# Altium schematic sheet Microcontroller.SchDoc
size B; SheetNumber: 2; SheetTotal: 7
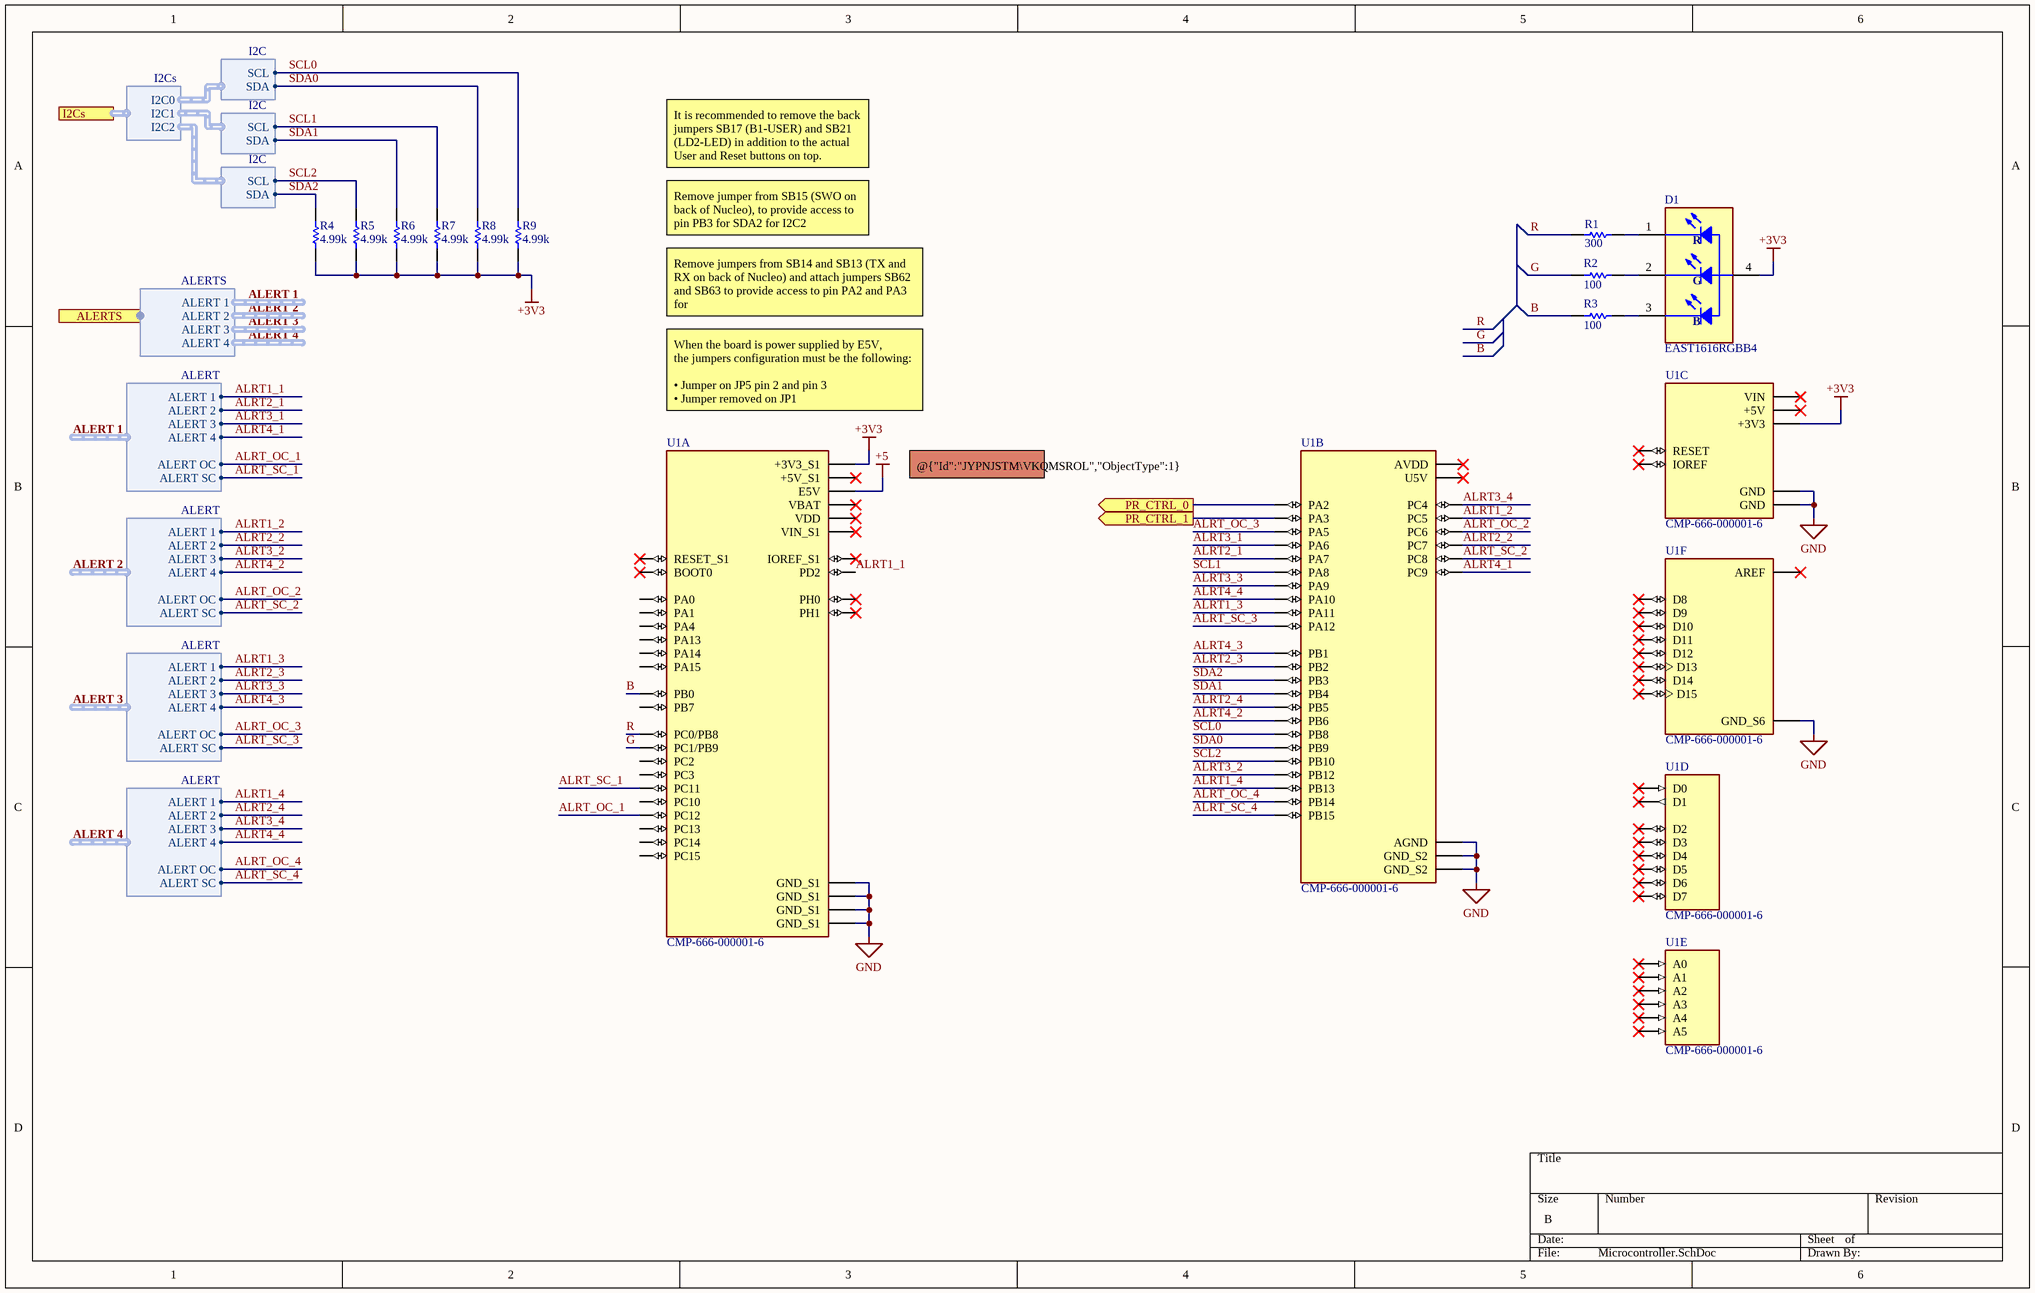
[diagram p0: Microcontroller.SchDoc]

## Parts
D1  EAST1616RGBB4  [FP-EAST1616RGBB4-MFG]
R1  value 300  [RES 0805_2012]  (hidden comment: ERJ-6ENF3000V)
R2  value 100  [RES 0805_2012]  (hidden comment: CRG0805F100R)
R3  value 100  [RES 0805_2012]  (hidden comment: CRG0805F100R)
R4  value 4.99k  [RES 0805_2012]  (hidden comment: ERJ-6ENF4991V)
R5  value 4.99k  [RES 0805_2012]  (hidden comment: ERJ-6ENF4991V)
R6  value 4.99k  [RES 0805_2012]  (hidden comment: ERJ-6ENF4991V)
R7  value 4.99k  [RES 0805_2012]  (hidden comment: ERJ-6ENF4991V)
R8  value 4.99k  [RES 0805_2012]  (hidden comment: ERJ-6ENF4991V)
R9  value 4.99k  [RES 0805_2012]  (hidden comment: ERJ-6ENF4991V)
U1  CMP-666-000001-6  [ST_NUCLEO-F401RE]  (parts A,B,C,D,E,F of 6)

## Ports
ALERTS (out, harness ALERTS), I2Cs (harness I2Cs), PR_CTRL_0 (out), PR_CTRL_1 (out)

## Harnesses
I2C: SDA, SCL
I2Cs: I2C1, I2C0, I2C2
ALERTS: ALERT 1, ALERT 2, ALERT 3, ALERT 4
ALERT: ALERT SC, ALERT OC, ALERT 1, ALERT 2, ALERT 3, ALERT 4

## Nets
+3V3: D1.4(COMMON_ANODE) R4.1 R5.1 R6.1 R7.1 R8.1 R9.1 U1.CN6_4(+3V3) U1.CN7_16(+3V3_S1)
+5: U1.CN7_6(E5V)
GND: U1.CN5_7(GND_S6) U1.CN6_6(GND) U1.CN6_7(GND) U1.CN7_8(GND_S1) U1.CN7_19(GND_S1) U1.CN7_20(GND_S1) U1.CN7_22(GND_S1) U1.CN10_9(GND_S2) U1.CN10_20(GND_S2) U1.CN10_32(AGND)
ALRT1_1: U1.CN7_4(PD2) ; harness ALERT.ALERT 1  [project net ALERT 1.ALERT 1]
ALRT1_2: U1.CN10_6(PC5) ; harness ALERT.ALERT 1  [project net ALERT 2.ALERT 1]
ALRT1_3: U1.CN10_14(PA11) ; harness ALERT.ALERT 1  [project net ALERT 3.ALERT 1]
ALRT1_4: U1.CN10_30(PB13) ; harness ALERT.ALERT 1  [project net ALERT 4.ALERT 1]
ALRT2_1: U1.CN10_15(PA7) ; harness ALERT.ALERT 2  [project net ALERT 1.ALERT 2]
ALRT2_2: U1.CN10_19(PC7) ; harness ALERT.ALERT 2  [project net ALERT 2.ALERT 2]
ALRT2_3: U1.CN10_22(PB2) ; harness ALERT.ALERT 2  [project net ALERT 3.ALERT 2]
ALRT2_4: U1.CN10_29(PB5) ; harness ALERT.ALERT 2  [project net ALERT 4.ALERT 2]
ALRT3_1: U1.CN10_13(PA6) ; harness ALERT.ALERT 3  [project net ALERT 1.ALERT 3]
ALRT3_2: U1.CN10_16(PB12) ; harness ALERT.ALERT 3  [project net ALERT 2.ALERT 3]
ALRT3_3: U1.CN10_21(PA9) ; harness ALERT.ALERT 3  [project net ALERT 3.ALERT 3]
ALRT3_4: U1.CN10_34(PC4) ; harness ALERT.ALERT 3  [project net ALERT 4.ALERT 3]
ALRT4_1: U1.CN10_1(PC9) ; harness ALERT.ALERT 4  [project net ALERT 1.ALERT 4]
ALRT4_2: U1.CN10_17(PB6) ; harness ALERT.ALERT 4  [project net ALERT 2.ALERT 4]
ALRT4_3: U1.CN10_24(PB1) ; harness ALERT.ALERT 4  [project net ALERT 3.ALERT 4]
ALRT4_4: U1.CN10_33(PA10) ; harness ALERT.ALERT 4  [project net ALERT 4.ALERT 4]
ALRT_OC_1: U1.CN7_3(PC12) ; harness ALERT.ALERT OC  [project net ALERT 1.ALERT OC]
ALRT_OC_2: U1.CN10_4(PC6) ; harness ALERT.ALERT OC  [project net ALERT 2.ALERT OC]
ALRT_OC_3: U1.CN10_11(PA5) ; harness ALERT.ALERT OC  [project net ALERT 3.ALERT OC]
ALRT_OC_4: U1.CN10_28(PB14) ; harness ALERT.ALERT OC  [project net ALERT 4.ALERT OC]
ALRT_SC_1: U1.CN7_2(PC11) ; harness ALERT.ALERT SC  [project net ALERT 1.ALERT SC]
ALRT_SC_2: U1.CN10_2(PC8) ; harness ALERT.ALERT SC  [project net ALERT 2.ALERT SC]
ALRT_SC_3: U1.CN10_12(PA12) ; harness ALERT.ALERT SC  [project net ALERT 3.ALERT SC]
ALRT_SC_4: U1.CN10_26(PB15) ; harness ALERT.ALERT SC  [project net ALERT 4.ALERT SC]
B: R3.1 U1.CN7_34(PB0)
G: R2.1 U1.CN7_36(PC1/PB9)
PR_CTRL_0: U1.CN10_35(PA2) ; port PR_CTRL_0
PR_CTRL_1: U1.CN10_37(PA3) ; port PR_CTRL_1
R: R1.1 U1.CN7_38(PC0/PB8)
SCL0: R9.2 U1.CN10_3(PB8) ; harness I2C.SCL
SCL1: R7.2 U1.CN10_23(PA8) ; harness I2C.SCL
SCL2: R5.2 U1.CN10_25(PB10) ; harness I2C.SCL
SDA0: R8.2 U1.CN10_5(PB9) ; harness I2C.SDA
SDA1: R6.2 U1.CN10_27(PB4) ; harness I2C.SDA
SDA2: R4.2 U1.CN10_31(PB3) ; harness I2C.SDA
NetD1_1: D1.1(RED_C) R1.2
NetD1_2: D1.2(GREEN_C) R2.2
NetD1_3: D1.3(BLUE_C) R3.2

Not connected (* = marked no-connect by the designer): U1 CN5_1(D8)* CN5_2(D9)* CN5_3(D10)* CN5_4(D11)* CN5_5(D12)* CN5_6(D13)* CN5_8(AREF)* CN5_9(D14)* CN5_10(D15)* CN6_2(IOREF)* CN6_3(RESET)* CN6_5(+5V)* CN6_8(VIN)* CN7_1(PC10) CN7_5(VDD)* CN7_7(BOOT0)* CN7_12(IOREF_S1)* CN7_13(PA13) CN7_14(RESET_S1)* CN7_15(PA14) CN7_17(PA15) CN7_18(+5V_S1)* CN7_21(PB7) CN7_23(PC13) CN7_24(VIN_S1)* CN7_25(PC14) CN7_27(PC15) CN7_28(PA0) CN7_29(PH0)* CN7_30(PA1) CN7_31(PH1)* CN7_32(PA4) CN7_33(VBAT)* CN7_35(PC2) CN7_37(PC3) CN8_1(A0)* CN8_2(A1)* CN8_3(A2)* CN8_4(A3)* CN8_5(A4)* CN8_6(A5)* CN9_1(D0)* CN9_2(D1)* CN9_3(D2)* CN9_4(D3)* CN9_5(D4)* CN9_6(D5)* CN9_7(D6)* CN9_8(D7)* CN10_7(AVDD)* CN10_8(U5V)*

## Notes on the sheet
- It is recommended to remove the back jumpers SB17 (B1-USER) and SB21 (LD2-LED) in addition to the actual User and Reset buttons on top.
- Remove jumper from SB15 (SWO on back of Nucleo), to provide access to pin PB3 for SDA2 for I2C2
- Remove jumpers from SB14 and SB13 (TX and RX on back of Nucleo) and attach jumpers SB62 and SB63 to provide access to pin PA2 and PA3 for @{"Id":"NLACXOFP\VKMUSWHO","ObjectType":1} and @{"Id":"NLACXOFP\SSHGJBFH","ObjectType":1}
- When the board is power supplied by E5V,
  the jumpers configuration must be the following:
  • Jumper on JP5 pin 2 and pin 3
  • Jumper removed on JP1
- @{"Id":"JYPNJSTM\VKQMSROL","ObjectType":1} 500mA MAX
- (in symbol CMP-007-00050-1) R; G; B

## Library data of the parts
D1 = CMP-007-00050-1: Triple Color LED; RoHS Compliant: Yes
R1 = CMP-009-00014-1: Fixed Resistor, Metal Glaze/thick Film, 0.125W, 300ohm, 150V, 1% +/-Tol, 100ppm/Cel, Surface Mount, 0805; Temperature Coefficient: 100ppm/°C; Power: 125mW; Package Height: 0.6mm; Package Length: 2mm; Package Width: 1.25mm; Rated Temperature: 70°C; Reference Standard: AEC-Q200; Tolerance: 1%; Max Operating Temperature: 155°C; Pins: 2; Reach SVHC Compliant: Yes; Packaging: Tape and Reel; RoHS Compliant: Yes; Case/Package: 0805; Termination: Wraparound; Resistor Type: FIXED RESISTOR; Construction: Rectangular; Mounting Technology: Surface Mount; Min Operating Temperature: -55°C; JESD-609 Code: e3; Package Shape: Rectangular; Package Style: SMTMeter; Technology: METAL GLAZE/THICK FILM; Terminal Finish: Nickel; Working Voltage: 150V
R2 R3 = CMP-009-00015-2: Fixed Resistor, Metal Glaze/thick Film, 0.125W, 100ohm, 150V, 1% +/-Tol, 200ppm/Cel, Surface Mount, 0805; Manufacturer Series: CRG; Manufacturer: TE Connectivity; Temperature Coefficient: 200ppm/°C; Additional Feature: LASER TRIMMABLE; MF: {'manufacturer': u'TE Connectivity'}; Rated Temperature: 70°C; Power: 125mW; Max Operating Temperature: 125°C; Design Item ID: CRG0805F100R; Working Voltage: 150V; Technology: METAL GLAZE/THICK FILM; Tolerance: 1%; Price: None; JESD-609 Code: e3; Mounting Technology: Surface Mount; MP: CRG0805F100R; Terminal Finish: Tin; RoHS Compliant: Yes; Case/Package: 0805; Availability: Unavailable; Pins: 2; Min Operating Temperature: -55°C; Source: CRG0805F100R.SchLib; Termination: Wraparound; Resistor Type: FIXED RESISTOR; Packaging: Tape and Reel; Package Shape: Rectangular; Component Type: Resistors; Manufacturer Part Number: CRG0805F100R
R4 R5 = CMP-009-00018-1: Fixed Resistor, Metal Glaze/thick Film, 0.125W, 4990ohm, 150V, 1% +/-Tol, 100ppm/Cel, Surface Mount, 0805; Package Width: 1.25mm; Rated Temperature: 70°C; Package Height: 0.6mm; Temperature Coefficient: 100ppm/°C; Reference Standard: AEC-Q200; Package Length: 2mm; Power: 125mW; Pins: 2; Termination: Wraparound; Package Style: SMTMeter; Working Voltage: 150V; Resistor Type: FIXED RESISTOR; Tolerance: 1%; Terminal Finish: Nickel; Packaging: Tape and Reel; Case/Package: 0805; Max Operating Temperature: 155°C; RoHS Compliant: Yes; Construction: Rectangular; Package Shape: Rectangular; Mounting Technology: Surface Mount; JESD-609 Code: e3; Reach SVHC Compliant: Yes; Min Operating Temperature: -55°C; Technology: METAL GLAZE/THICK FILM
R6-R9 = CMP-009-00018-1: Fixed Resistor, Metal Glaze/thick Film, 0.125W, 4990ohm, 150V, 1% +/-Tol, 100ppm/Cel, Surface Mount, 0805; Power: 125mW; Temperature Coefficient: 100ppm/°C; Package Length: 2mm; Package Width: 1.25mm; Rated Temperature: 70°C; Package Height: 0.6mm; Reference Standard: AEC-Q200; Tolerance: 1%; JESD-609 Code: e3; Resistor Type: FIXED RESISTOR; Construction: Rectangular; Case/Package: 0805; Reach SVHC Compliant: Yes; Max Operating Temperature: 155°C; Package Shape: Rectangular; RoHS Compliant: Yes; Packaging: Tape and Reel; Pins: 2; Package Style: SMTMeter; Min Operating Temperature: -55°C; Working Voltage: 150V; Termination: Wraparound; Technology: METAL GLAZE/THICK FILM; Mounting Technology: Surface Mount; Terminal Finish: Nickel
U1 = CMP-752-000003-2: STM32F401RE Embedded Nucleo STM32F4 MCU 32-Bit ARM Cortex-M3 Evaluation Board; MP: NUCLEO-F401RE; MF: STMicroelectronics; Design Item ID: NUCLEO-F401RE; Source: NUCLEO-F401RE.SchLib